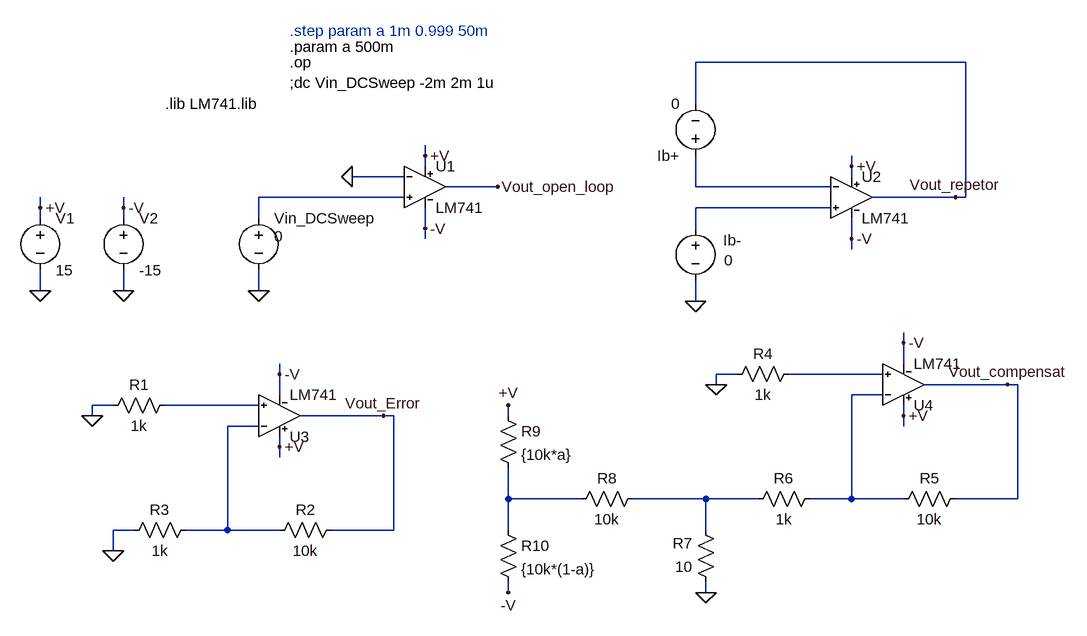
[diagram p0: schematic DC_params.asc]
DC_params.asc, the LTspice schematic file:
Version 4
SHEET 1 964 1668
WIRE 128 240 -288 240
WIRE -288 304 -288 240
WIRE -704 384 -704 368
WIRE -704 400 -704 384
WIRE -48 400 -48 384
WIRE -736 416 -816 416
WIRE -48 416 -48 400
WIRE -592 432 -672 432
WIRE -288 432 -288 384
WIRE -80 432 -288 432
WIRE -736 448 -960 448
WIRE 112 448 -16 448
WIRE 128 448 128 240
WIRE 128 448 112 448
WIRE -1296 464 -1296 448
WIRE -1168 464 -1168 448
WIRE -80 464 -288 464
WIRE -1296 480 -1296 464
WIRE -1168 480 -1168 464
WIRE -960 480 -960 448
WIRE -704 496 -704 464
WIRE -288 496 -288 464
WIRE -704 512 -704 496
WIRE -48 512 -48 480
WIRE -48 528 -48 512
WIRE -1296 592 -1296 560
WIRE -1168 592 -1168 560
WIRE -960 592 -960 560
WIRE -288 608 -288 576
WIRE 32 672 32 656
WIRE 32 704 32 672
WIRE -928 720 -928 704
WIRE -224 720 -256 720
WIRE 0 720 -144 720
WIRE -256 736 -256 720
WIRE 192 736 64 736
WIRE 208 736 192 736
WIRE -928 752 -928 720
WIRE 0 752 -48 752
WIRE -1184 768 -1216 768
WIRE -960 768 -1104 768
WIRE -1216 784 -1216 768
WIRE -768 784 -896 784
WIRE -752 784 -768 784
WIRE -576 784 -576 768
WIRE 32 784 32 768
WIRE -960 800 -1008 800
WIRE 32 800 32 784
WIRE -928 832 -928 816
WIRE -928 848 -928 832
WIRE -576 912 -576 864
WIRE -464 912 -576 912
WIRE -272 912 -384 912
WIRE -192 912 -272 912
WIRE -48 912 -48 752
WIRE -48 912 -112 912
WIRE 32 912 -48 912
WIRE 208 912 208 736
WIRE 208 912 112 912
WIRE -1152 960 -1184 960
WIRE -1008 960 -1008 800
WIRE -1008 960 -1072 960
WIRE -928 960 -1008 960
WIRE -752 960 -752 784
WIRE -752 960 -848 960
WIRE -576 960 -576 912
WIRE -272 960 -272 912
WIRE -1184 992 -1184 960
WIRE -576 1056 -576 1040
WIRE -272 1056 -272 1040
FLAG -592 432 Vout_open_loop
FLAG -960 592 0
FLAG -1296 592 0
FLAG -1168 592 0
FLAG -1296 464 +V
FLAG -704 384 +V
FLAG -1168 464 -V
FLAG -704 496 -V
FLAG -816 416 0
FLAG -288 608 0
FLAG -48 400 +V
FLAG -48 512 -V
FLAG 112 448 Vout_repetor
FLAG -928 832 +V
FLAG -928 720 -V
FLAG -1216 784 0
FLAG -1184 992 0
FLAG -768 784 Vout_Error
FLAG -256 736 0
FLAG 192 736 Vout_compensat
FLAG -272 1056 0
FLAG -576 768 +V
FLAG -576 1056 -V
FLAG 32 784 +V
FLAG 32 672 -V
DATAFLAG 128 336 ""
DATAFLAG -752 864 ""
DATAFLAG -192 432 ""
DATAFLAG -256 464 ""
DATAFLAG -512 912 ""
DATAFLAG -240 912 ""
DATAFLAG 160 912 ""
SYMBOL LM741 -704 368 R0
SYMATTR InstName U1
SYMBOL voltage -1296 464 R0
WINDOW 123 0 0 Left 2
WINDOW 39 0 0 Left 2
SYMATTR InstName V1
SYMATTR Value 15
SYMBOL voltage -1168 464 R0
WINDOW 123 0 0 Left 2
WINDOW 39 0 0 Left 2
SYMATTR InstName V2
SYMATTR Value -15
SYMBOL voltage -960 464 R0
WINDOW 3 24 44 Left 2
WINDOW 123 24 72 Left 2
WINDOW 39 0 0 Left 2
SYMATTR Value 0
SYMATTR InstName Vin_DCSweep
SYMBOL LM741 -48 384 R0
SYMATTR InstName U2
SYMBOL voltage -288 480 R0
WINDOW 3 44 65 Left 2
WINDOW 123 24 72 Left 2
WINDOW 39 0 0 Left 2
WINDOW 0 43 34 Left 2
SYMATTR Value 0
SYMATTR InstName Ib-
SYMBOL voltage -288 400 R180
WINDOW 123 0 0 Left 0
WINDOW 39 0 0 Left 0
SYMATTR InstName Ib+
SYMATTR Value 0
SYMBOL LM741 -928 848 M180
SYMATTR InstName U3
SYMBOL res -1088 752 R90
WINDOW 0 0 56 VBottom 2
WINDOW 3 32 56 VTop 2
SYMATTR InstName R1
SYMATTR Value 1k
SYMBOL res -832 944 R90
WINDOW 0 0 56 VBottom 2
WINDOW 3 32 56 VTop 2
SYMATTR InstName R2
SYMATTR Value 10k
SYMBOL res -1056 944 R90
WINDOW 0 0 56 VBottom 2
WINDOW 3 32 56 VTop 2
SYMATTR InstName R3
SYMATTR Value 1k
SYMBOL res -128 704 R90
WINDOW 0 0 56 VBottom 2
WINDOW 3 32 56 VTop 2
SYMATTR InstName R4
SYMATTR Value 1k
SYMBOL res 128 896 R90
WINDOW 0 0 56 VBottom 2
WINDOW 3 32 56 VTop 2
SYMATTR InstName R5
SYMATTR Value 10k
SYMBOL res -96 896 R90
WINDOW 0 0 56 VBottom 2
WINDOW 3 32 56 VTop 2
SYMATTR InstName R6
SYMATTR Value 1k
SYMBOL res -256 1056 R180
WINDOW 0 36 76 Left 2
WINDOW 3 36 40 Left 2
SYMATTR InstName R7
SYMATTR Value 10
SYMBOL res -480 928 R270
WINDOW 0 32 56 VTop 2
WINDOW 3 0 56 VBottom 2
SYMATTR InstName R8
SYMATTR Value 10k
SYMBOL res -592 768 R0
SYMATTR InstName R9
SYMATTR Value {10k*a}
SYMBOL res -592 944 R0
SYMATTR InstName R10
SYMATTR Value {10k*(1-a)}
SYMBOL LM741 32 800 M180
SYMATTR InstName U4
TEXT -1104 304 Left 2 !.lib LM741.lib
TEXT -912 240 Left 2 !.op
TEXT -912 192 Left 2 ;.step param a 1m 0.999 50m
TEXT -912 272 Left 2 !;dc Vin_DCSweep -2m 2m 1u
TEXT -912 216 Left 2 !.param a 500m

The netlist it stands for:
* DC_params.asc
XU1 N002 0 +V -V Vout_open_loop LM741  ; pins In+ In- V+ V- OUT
V1 +V 0 15
V2 -V 0 -15
Vin_DCSweep N002 0 0
XU2 N003 N001 +V -V Vout_repetor LM741  ; pins In+ In- V+ V- OUT
V§Ib- N003 0 0
V§Ib+ N001 Vout_repetor 0
XU3 N006 N007 +V -V Vout_Error LM741  ; pins In+ In- V+ V- OUT
R1 N006 0 1k
R2 Vout_Error N007 10k
R3 N007 0 1k
R4 N004 0 1k
R5 Vout_compensat N005 10k
R6 N005 N009 1k
R7 0 N009 10
R8 N008 N009 10k
R9 +V N008 {10k*a}
R10 N008 -V {10k*(1-a)}
XU4 N004 N005 +V -V Vout_compensat LM741  ; pins In+ In- V+ V- OUT
.lib LM741.lib
.op
* .step param a 1m 0.999 50m
;dc Vin_DCSweep -2m 2m 1u
.param a 500m
.lib LM741.lib
.backanno
.end